# EAGLE design V1 (EAGLE 6.5.0)
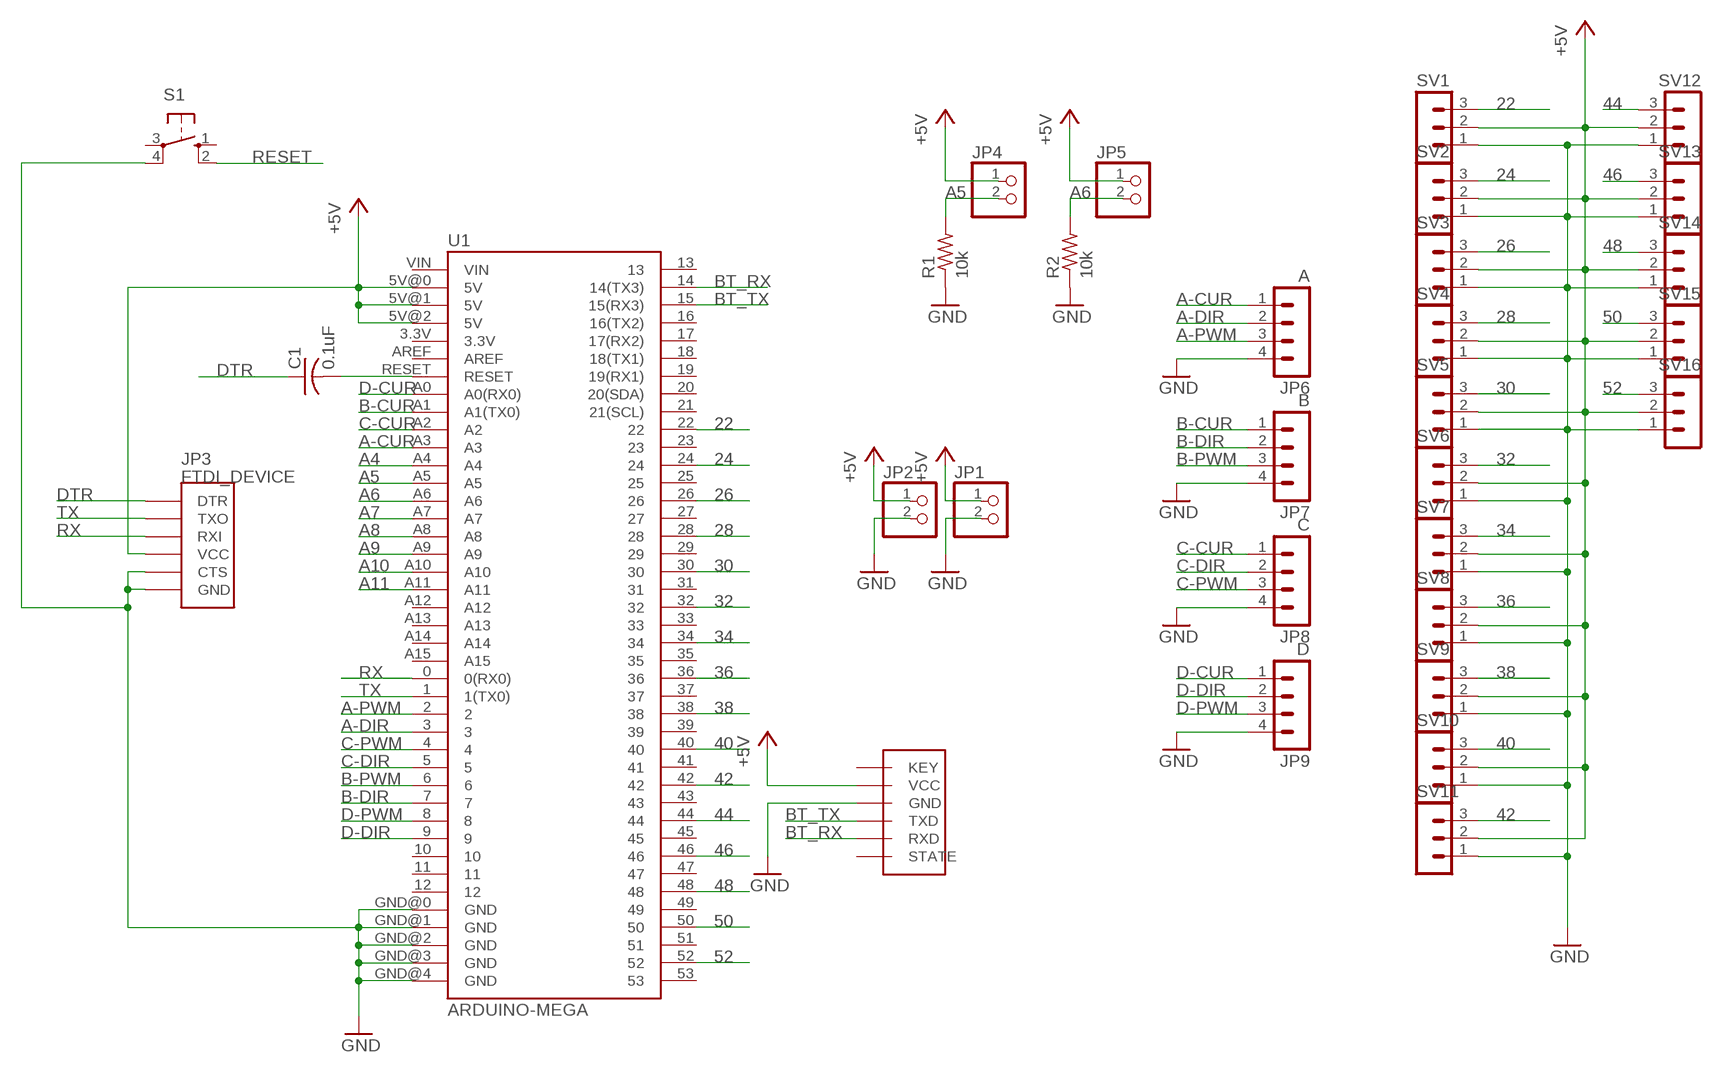
[diagram p0: schematic, sheet 1]

## Parts
BT1  BT_MODULEVERTICAL  [BT_MODULE_V]
C1  0.1uF  C-US025-024X044  [C025-024X044]
JP1  PINHD-1X2  [1X02]
JP2  PINHD-1X2  [1X02]
JP3  FTDI_DEVICE  [FTDI_DEVICE_SIDE]
JP4  PINHD-1X2  [1X02]
JP5  PINHD-1X2  [1X02]
JP6  A  MA04-1  [MA04-1]
JP7  B  MA04-1  [MA04-1]
JP8  C  MA04-1  [MA04-1]
JP9  D  MA04-1  [MA04-1]
R1  10k  R-US_0204/7  [0204/7]
R2  10k  R-US_0204/7  [0204/7]
S1  10-XX  [B3F-10XX]
SV1  MA03-1  [MA03-1]
SV2  MA03-1  [MA03-1]
SV3  MA03-1  [MA03-1]
SV4  MA03-1  [MA03-1]
SV5  MA03-1  [MA03-1]
SV6  MA03-1  [MA03-1]
SV7  MA03-1  [MA03-1]
SV8  MA03-1  [MA03-1]
SV9  MA03-1  [MA03-1]
SV10  MA03-1  [MA03-1]
SV11  MA03-1  [MA03-1]
SV12  MA03-1  [MA03-1]
SV13  MA03-1  [MA03-1]
SV14  MA03-1  [MA03-1]
SV15  MA03-1  [MA03-1]
SV16  MA03-1  [MA03-1]
U1  ARDUINO-MEGA  [ARDUINO_MEGA_PINS_ONLY]

## Nets
22: SV1.3 U1.22
24: SV2.3 U1.24
26: SV3.3 U1.26
28: SV4.3 U1.28
30: SV5.3 U1.30
32: SV6.3 U1.32
34: SV7.3 U1.34
36: SV8.3 U1.36
38: SV9.3 U1.38
40: SV10.3 U1.40
42: SV11.3 U1.42
44: SV12.3 U1.44
46: SV13.3 U1.46
48: SV14.3 U1.48
50: SV15.3 U1.50
52: SV16.3 U1.52
+5V: BT1.VCC JP1.1 JP2.1 JP3.P$4(VCC) JP4.1 JP5.1 SV1.2 SV2.2 SV3.2 SV4.2 SV5.2 SV6.2 SV7.2 SV8.2 SV9.2 SV10.2 SV11.2 SV12.2 SV13.2 SV14.2 SV15.2 SV16.2 U1.5V@0(5V) U1.5V@1(5V) U1.5V@2(5V)
A4: U1.A4
A5: JP4.2 R1.2 U1.A5
A6: JP5.2 R2.2 U1.A6
A7: U1.A7
A8: U1.A8
A9: U1.A9
A10: U1.A10
A11: U1.A11
A-CUR: JP6.1 U1.A3
A-DIR: JP6.2 U1.3
A-PWM: JP6.3 U1.2
B-CUR: JP7.1 U1.A1(A1(TX0))
B-DIR: JP7.2 U1.7
B-PWM: JP7.3 U1.6
BT_RX: BT1.RXD U1.14(14(TX3))
BT_TX: BT1.TXD U1.15(15(RX3))
C-CUR: JP8.1 U1.A2
C-DIR: JP8.2 U1.5
C-PWM: JP8.3 U1.4
D-CUR: JP9.1 U1.A0(A0(RX0))
D-DIR: JP9.2 U1.9
D-PWM: JP9.3 U1.8
DTR: C1.1 JP3.P$1(DTR)
GND: BT1.GND JP1.2 JP2.2 JP3.P$5(CTS) JP3.P$6(GND) JP6.4 JP7.4 JP8.4 JP9.4 R1.1 R2.1 S1.4(P1) SV1.1 SV2.1 SV3.1 SV4.1 SV5.1 SV6.1 SV7.1 SV8.1 SV9.1 SV10.1 SV11.1 SV12.1 SV13.1 SV14.1 SV15.1 SV16.1 U1.GND@0(GND) U1.GND@1(GND) U1.GND@2(GND) U1.GND@3(GND) U1.GND@4(GND)
RESET: C1.2 S1.2(S1) U1.RESET
RX: JP3.P$3(RXI) U1.0(0(RX0))
TX: JP3.P$2(TXO) U1.1(1(TX0))
Unconnected: BT1.KEY BT1.STATE S1.1(S) S1.3(P) U1.3.3V U1.10 U1.11 U1.12 U1.13 U1.16(16(TX2)) U1.17(17(RX2)) U1.18(18(TX1)) U1.19(19(RX1)) U1.20(20(SDA)) U1.21(21(SCL)) U1.23 U1.25 U1.27 U1.29 U1.31 U1.33 U1.35 U1.37 U1.39 U1.41 U1.43 U1.45 U1.47 U1.49 U1.51 U1.53 U1.A12 U1.A13 U1.A14 U1.A15 U1.AREF U1.VIN

## Library data of the parts
BT1 = Tallent:BT_MODULE
C1 = rcl:C-US: CAPACITOR, American symbol
JP1 JP2 JP4 JP5 = pinhead:PINHD-1X2: PIN HEADER
JP3 = SparkFun-Connectors:FTDI_DEVICE: Connector which mates to FTDI basic or FTDI cable.
JP6-JP9 = con-lstb:MA04-1: PIN HEADER; OC_FARNELL: unknown; OC_NEWARK: unknown
R1 R2 = rcl:R-US_: RESISTOR, American symbol
S1 = switch-omron:10-XX: OMRON SWITCH; MPN: B3F-1000; OC_FARNELL: 176432; OC_NEWARK: 36M3542
SV1-SV16 = con-lstb:MA03-1: PIN HEADER
U1 = SparkFun-Boards:ARDUINO-MEGA: Arduino Mega board footprint

## Board
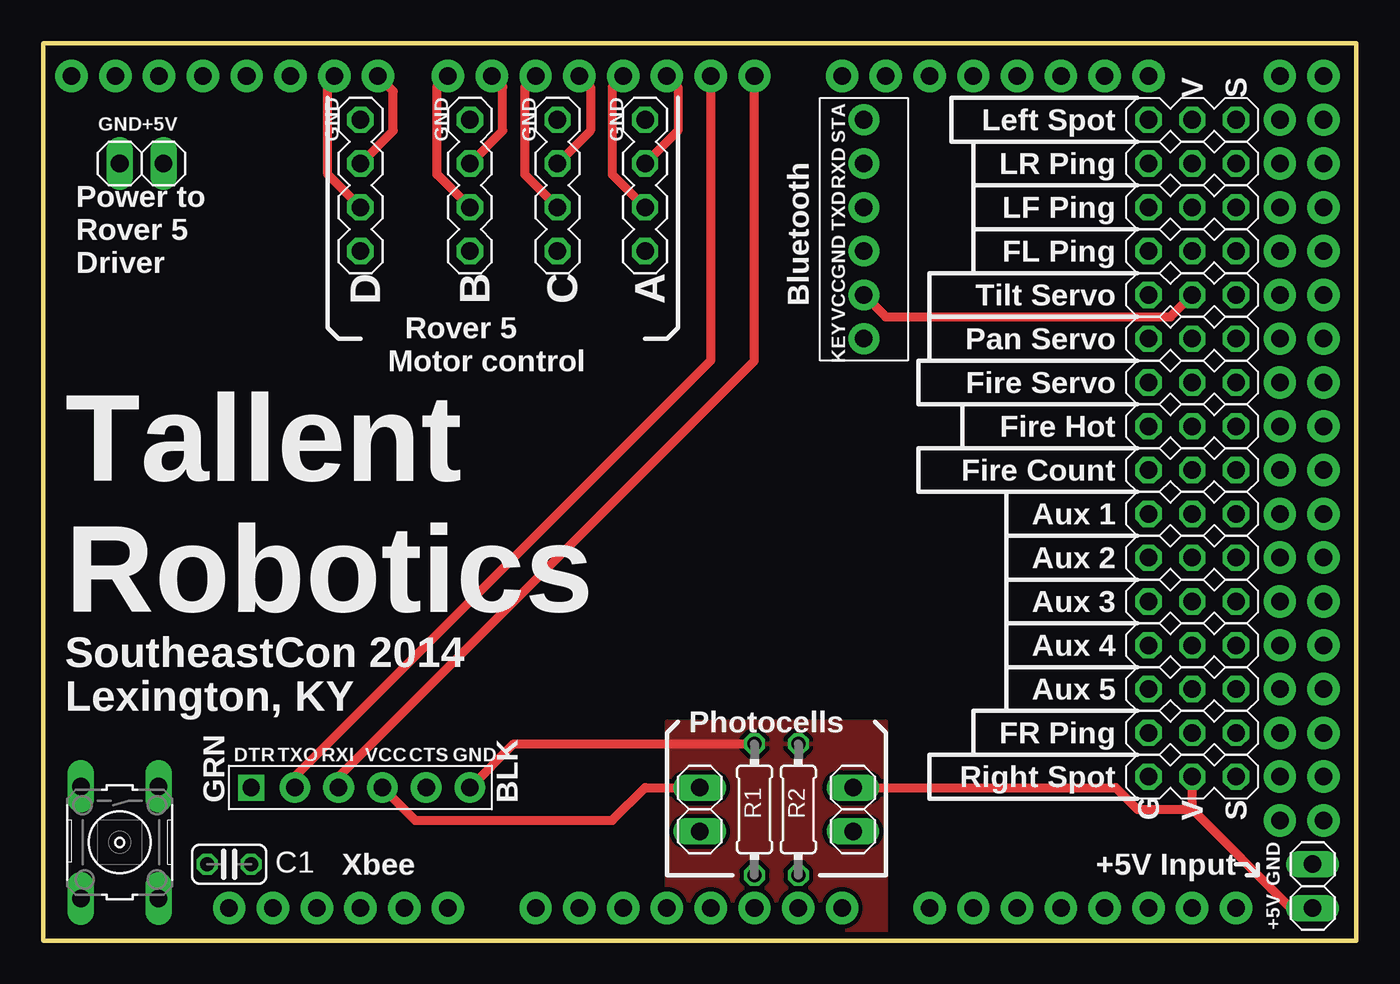
[diagram p1: board, top side]
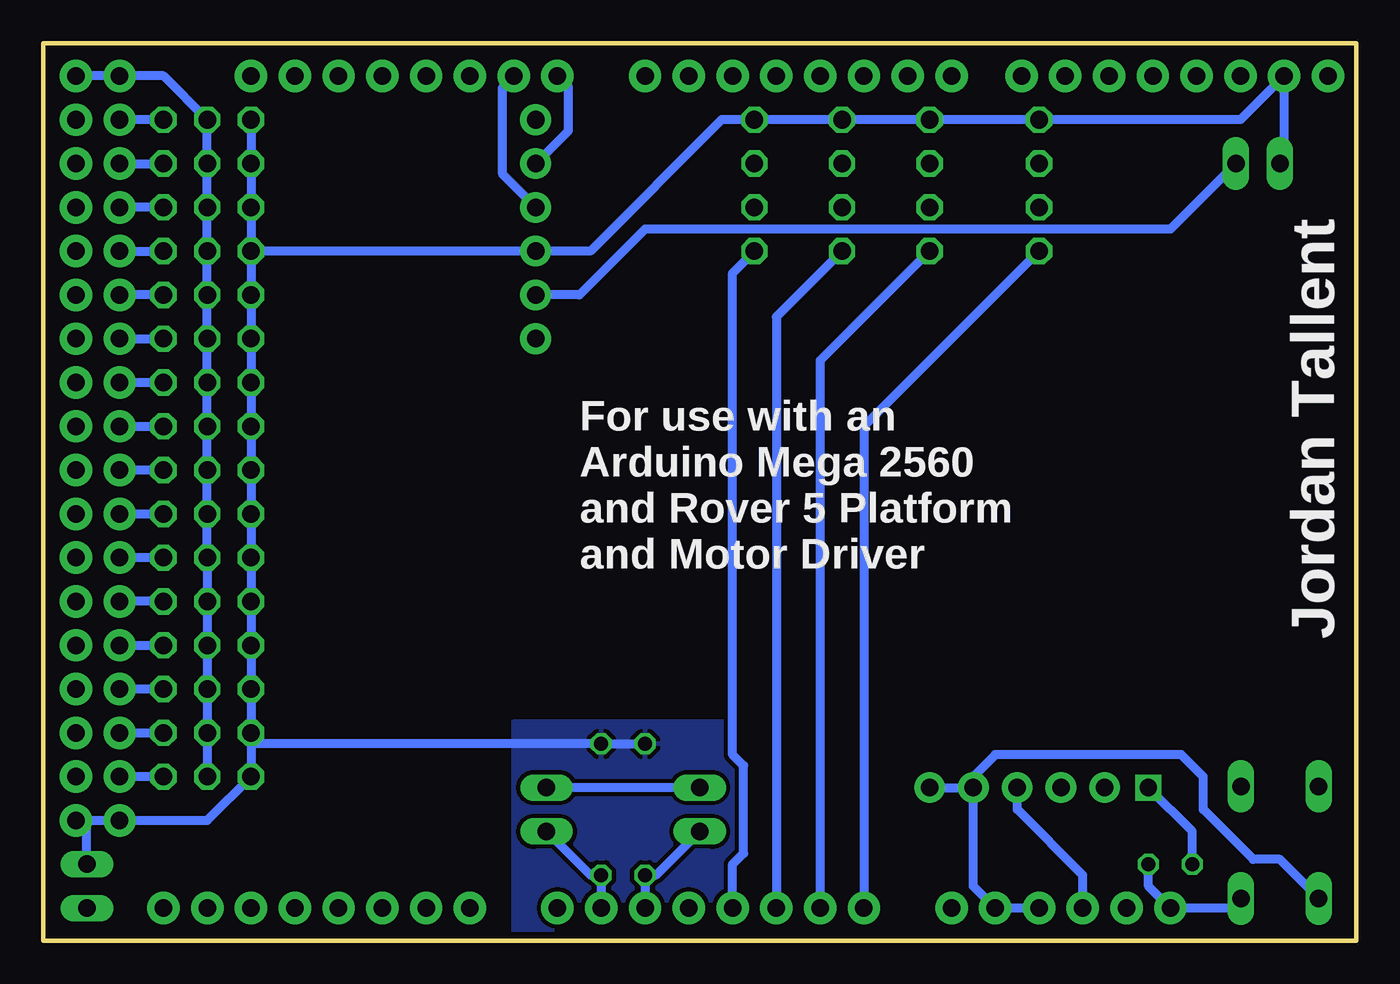
[diagram p2: board, bottom side, seen from below]

Size 76.2 x 52.07 mm. Coordinates in mm from the lower left corner, seen from the top.
Outline: 0,52.07 76.2,52.07 76.2,0 0,0 0,52.07
Copper layers (1*16): Top 0.0356mm / dielectric 1.5011mm / Bottom 0.0356mm
Design rules "OSHpark": minimum track width 6mil, minimum drill 13mil, track to track 6mil, track to pad 6mil, pad to pad 6mil, via to via 6mil, smd to smd 6mil, copper to edge 15mil, drill to drill 6mil, minimum pad ring 7mil, minimum via ring 7mil, stop-mask expansion 4mil, vias tented up to drill 0mil, thermal gap 10mil

### Footprints (pad centres in the part's own frame; a part is rotated, then mirrored left to right if it is on the bottom)
BT_MODULE_V = drill 1.016 pad 1.778: GND 1.27,0; KEY 6.35,0; RXD -3.81,0; STATE -6.35,0; TXD -1.27,0; VCC 3.81,0
C025-024X044 = drill 0.813 octagon: 1 -1.27,0; 2 1.27,0
1X02 = drill 1.016 long: 1 -1.27,0; 2 1.27,0
FTDI_DEVICE_SIDE = drill 1 square: P$1 -6.35,0 | drill 1.016 pad 1.778: P$2 -3.81,0; P$3 -1.27,0; P$4 1.27,0; P$5 3.81,0; P$6 6.35,0
MA04-1 = drill 1.016 octagon: 1 -2.54,0; 2 0,0; 3 2.54,0; 4 5.08,0
0204/7 = drill 0.813 octagon: 1 -3.81,0; 2 3.81,0
B3F-10XX = drill 1.016 long: 1 -3.251,2.261; 2 3.251,2.261; 3 -3.251,-2.261; 4 3.251,-2.261
MA03-1 = drill 1.016 octagon: 1 -2.54,0; 2 0,0; 3 2.54,0
ARDUINO_MEGA_PINS_ONLY = drill 1.016 pad 1.88: 0 30.48,48.26; 1 27.94,48.26; 2 25.4,48.26; 3 22.86,48.26; 3.3V 2.54,0; 4 20.32,48.26; 5 17.78,48.26; 5V@0 5.08,0; 5V@1 60.96,48.26; 5V@2 63.5,48.26; 6 15.24,48.26; 7 12.7,48.26; 8 8.636,48.26; 9 6.096,48.26; 10 3.556,48.26; 11 1.016,48.26; 12 -1.524,48.26; 13 -4.064,48.26; 14 35.56,48.26; 15 38.1,48.26; 16 40.64,48.26; 17 43.18,48.26; 18 45.72,48.26; 19 48.26,48.26; 20 50.8,48.26; 21 53.34,48.26; 22 60.96,45.72; 23 63.5,45.72; 24 60.96,43.18; 25 63.5,43.18; 26 60.96,40.64; 27 63.5,40.64; 28 60.96,38.1; 29 63.5,38.1; 30 60.96,35.56; 31 63.5,35.56; 32 60.96,33.02; 33 63.5,33.02; 34 60.96,30.48; 35 63.5,30.48; 36 60.96,27.94; 37 63.5,27.94; 38 60.96,25.4; 39 63.5,25.4; 40 60.96,22.86; 41 63.5,22.86; 42 60.96,20.32; 43 63.5,20.32; 44 60.96,17.78; 45 63.5,17.78; 46 60.96,15.24; 47 63.5,15.24; 48 60.96,12.7; 49 63.5,12.7; 50 60.96,10.16; 51 63.5,10.16; 52 60.96,7.62; 53 63.5,7.62; A0 17.78,0; A1 20.32,0; A2 22.86,0; A3 25.4,0; A4 27.94,0; A5 30.48,0; A6 33.02,0; A7 35.56,0; A8 40.64,0; A9 43.18,0; A10 45.72,0; A11 48.26,0; A12 50.8,0; A13 53.34,0; A14 55.88,0; A15 58.42,0; AREF -9.144,48.26; GND@0 7.62,0; GND@1 10.16,0; GND@2 60.96,5.08; GND@3 63.5,5.08; GND@4 -6.604,48.26; RESET 0,0; VIN 12.7,0

### Placement (x,y rotation side)
BT1  47.62,41.27 270 top
C1  10.79,4.45 0 top
JP1  5.71,45.09 180 top
JP2  73.66,3.17 90 top
JP3  18.41,8.89 0 top
JP4  38.1,7.62 270 top
JP5  46.99,7.62 270 top
JP6  34.93,42.54 90 top
JP7  24.76,42.54 90 top
JP8  29.84,42.54 90 top
JP9  18.41,42.54 90 top
R1  41.27,7.62 270 top
R2  43.82,7.62 270 top
S1  4.45,5.71 270 top
SV1  66.67,47.62 0 top
SV2  66.67,45.09 0 top
SV3  66.67,42.54 0 top
SV4  66.67,40 0 top
SV5  66.67,37.46 0 top
SV6  66.67,34.92 0 top
SV7  66.67,32.38 0 top
SV8  66.67,29.85 0 top
SV9  66.67,27.31 0 top
SV10  66.67,24.77 0 top
SV11  66.67,22.23 0 top
SV12  66.67,19.69 0 top
SV13  66.67,17.15 0 top
SV14  66.67,14.61 0 top
SV15  66.67,12.06 0 top
SV16  66.67,9.53 0 top
U1  10.79,1.91 0 top

### Tracks (layer width: path | path; a pad name or v marks a point on that pad's centre or on a via)
22
  Bottom 0.508: SV1.3 U1.22
24
  Bottom 0.508: U1.24 SV2.3
26
  Bottom 0.508: SV3.3 U1.26
28
  Bottom 0.508: U1.28 SV4.3
30
  Bottom 0.508: SV5.3 U1.30
32
  Bottom 0.508: U1.32 SV6.3
34
  Bottom 0.508: SV7.3 U1.34
36
  Bottom 0.508: U1.36 SV8.3
38
  Bottom 0.508: SV9.3 U1.38
40
  Bottom 0.508: U1.40 SV10.3
42
  Bottom 0.508: SV11.3 U1.42
44
  Bottom 0.508: SV12.3 U1.44
46
  Bottom 0.508: U1.46 SV13.3
48
  Bottom 0.508: SV14.3 U1.48
50
  Bottom 0.508: U1.50 SV15.3
52
  Bottom 0.508: SV16.3 U1.52
+5V
  Top 0.508: BT1.VCC 48.9,36.2 65.41,36.2 SV5.2 | JP2.1 72.39,1.91 66.67,7.62 | 66.67,7.62 SV16.2 | JP5.1 62.23,8.89 63.5,7.62 66.67,7.62 | JP3.P$4 21.59,6.98 33.02,6.98 34.93,8.89 JP4.1
  Bottom 0.508: U1.5V@2 U1.5V@1 69.21,50.16 SV1.2 SV2.2 SV3.2 SV4.2 SV5.2 SV6.2 SV7.2 SV8.2 SV9.2 SV10.2 SV11.2 SV12.2 SV13.2 SV14.2 SV15.2 SV16.2 | JP1.1 10.79,41.27 41.27,41.27 45.09,37.46 BT1.VCC | JP4.1 JP5.1 | U1.5V@0 15.88,3.81 19.68,7.62 JP3.P$4
A5
  Bottom 0.508: JP4.2 40.64,3.81 R1.2 U1.A5
A6
  Bottom 0.508: JP5.2 44.45,3.81 R2.2 U1.A6
A-CUR
  Bottom 0.508: JP6.1 36.2,38.73 36.2,10.79 35.56,10.16 35.56,5.08 36.2,4.45 U1.A3
A-DIR
  Top 0.508: U1.3 33.02,49.53 33.02,44.45 JP6.2
A-PWM
  Top 0.508: U1.2 36.83,49.53 36.83,46.99 JP6.3
B-CUR
  Bottom 0.508: JP7.1 31.11,33.66 U1.A1
B-DIR
  Top 0.508: JP7.2 22.86,44.45 22.86,49.53 U1.7
B-PWM
  Top 0.508: JP7.3 26.67,46.99 26.67,49.53 U1.6
BT_RX
  Bottom 0.508: BT1.RXD 45.72,46.99 45.72,49.53 U1.14
BT_TX
  Bottom 0.508: BT1.TXD 49.53,44.45 49.53,49.53 U1.15
C-CUR
  Bottom 0.508: JP8.1 33.66,36.2 U1.A2
C-DIR
  Top 0.508: U1.5 27.94,49.53 27.94,44.45 JP8.2
C-PWM
  Top 0.508: U1.4 31.75,49.53 31.75,46.99 JP8.3
D-CUR
  Bottom 0.508: JP9.1 28.57,29.85 U1.A0
D-DIR
  Top 0.508: JP9.2 16.51,44.45 16.51,49.78 U1.9
D-PWM
  Top 0.508: JP9.3 20.32,46.99 20.32,49.28 U1.8
DTR
  Bottom 0.508: C1.1 9.53,6.35 JP3.P$1
GND
  Top 0.508: JP3.P$6 27.3,11.43 R1.1
  Bottom 0.508: R1.1 R2.1 64.13,11.43 | SV1.1 SV2.1 SV3.1 SV4.1 | SV4.1 SV5.1 SV6.1 SV7.1 SV8.1 SV9.1 SV10.1 SV11.1 SV12.1 SV13.1 SV14.1 SV15.1 64.13,11.43 | U1.GND@3 73.66,6.98 | 73.66,6.98 U1.GND@2 66.67,6.98 SV16.1 64.13,11.43 | SV4.1 BT1.GND 44.45,40 36.83,47.62 JP6.4 JP8.4 JP7.4 JP9.4 6.73,47.62 U1.GND@4 4.19,45.34 JP1.2 | JP2.2 73.66,6.98 | S1.4 4.45,4.72 5.99,4.72 8.89,7.62 8.89,9.53 10.16,10.79 20.95,10.79 22.86,8.89 | JP3.P$6 22.86,8.89 | 22.86,8.89 JP3.P$5 22.22,3.17 U1.GND@1 U1.GND@0
  pour Bottom (isolate 0.254): 36.2,12.7 48.9,12.7 48.9,0 36.2,0
  pour Top (isolate 0.254): 36.2,12.7 48.9,12.7 48.9,0 36.2,0
RESET
  Bottom 0.508: C1.2 12.06,3.17 U1.RESET 7.26,1.91 S1.2
RX
  Top 0.508: U1.0 41.27,33.66 17.14,9.53 JP3.P$3
TX
  Top 0.508: U1.1 38.73,33.66 14.61,9.53 JP3.P$2

### Text on the board
tPlace: Left Spot | V | S | GND | +5V | GND | GND | GND | GND | LR Ping | LF Ping | FL Ping | Power to / Rover 5 / Driver | D | B | C | A | Tilt Servo | Bluetooth | Pan Servo | Rover 5 / Motor control | Fire Servo | Fire Hot | Fire Count | Aux 1 | Aux 2 | Aux 3 | Tallent / Robotics | Aux 4 | SoutheastCon 2014 | Aux 5 | Lexington, KY | FR Ping | Photocells | Right Spot | G | V | S | Xbee | +5V Input | GND | +5V
bPlace: Jordan Tallent | For use with an / Arduino Mega 2560 / and Rover 5 Platform / and Motor Driver